# Altium schematic sheet tigard.SchDoc: =DocumentName
size A3; Date: 2024/12/30; Author: 阳光电路; CompanyName: 阳光电路; DrawnBy: Sunshine Circuit; Engineer: 阳光电路; Organization: Sunshine Circuit; Address1: 中国; Address2: 浙江; Address3: 杭州; Address4: 西湖区; DocumentNumber: 1; Revision: Rev 1.0.0; Version: Ver 2.0.0; Size: A3; Time: 00:00:00
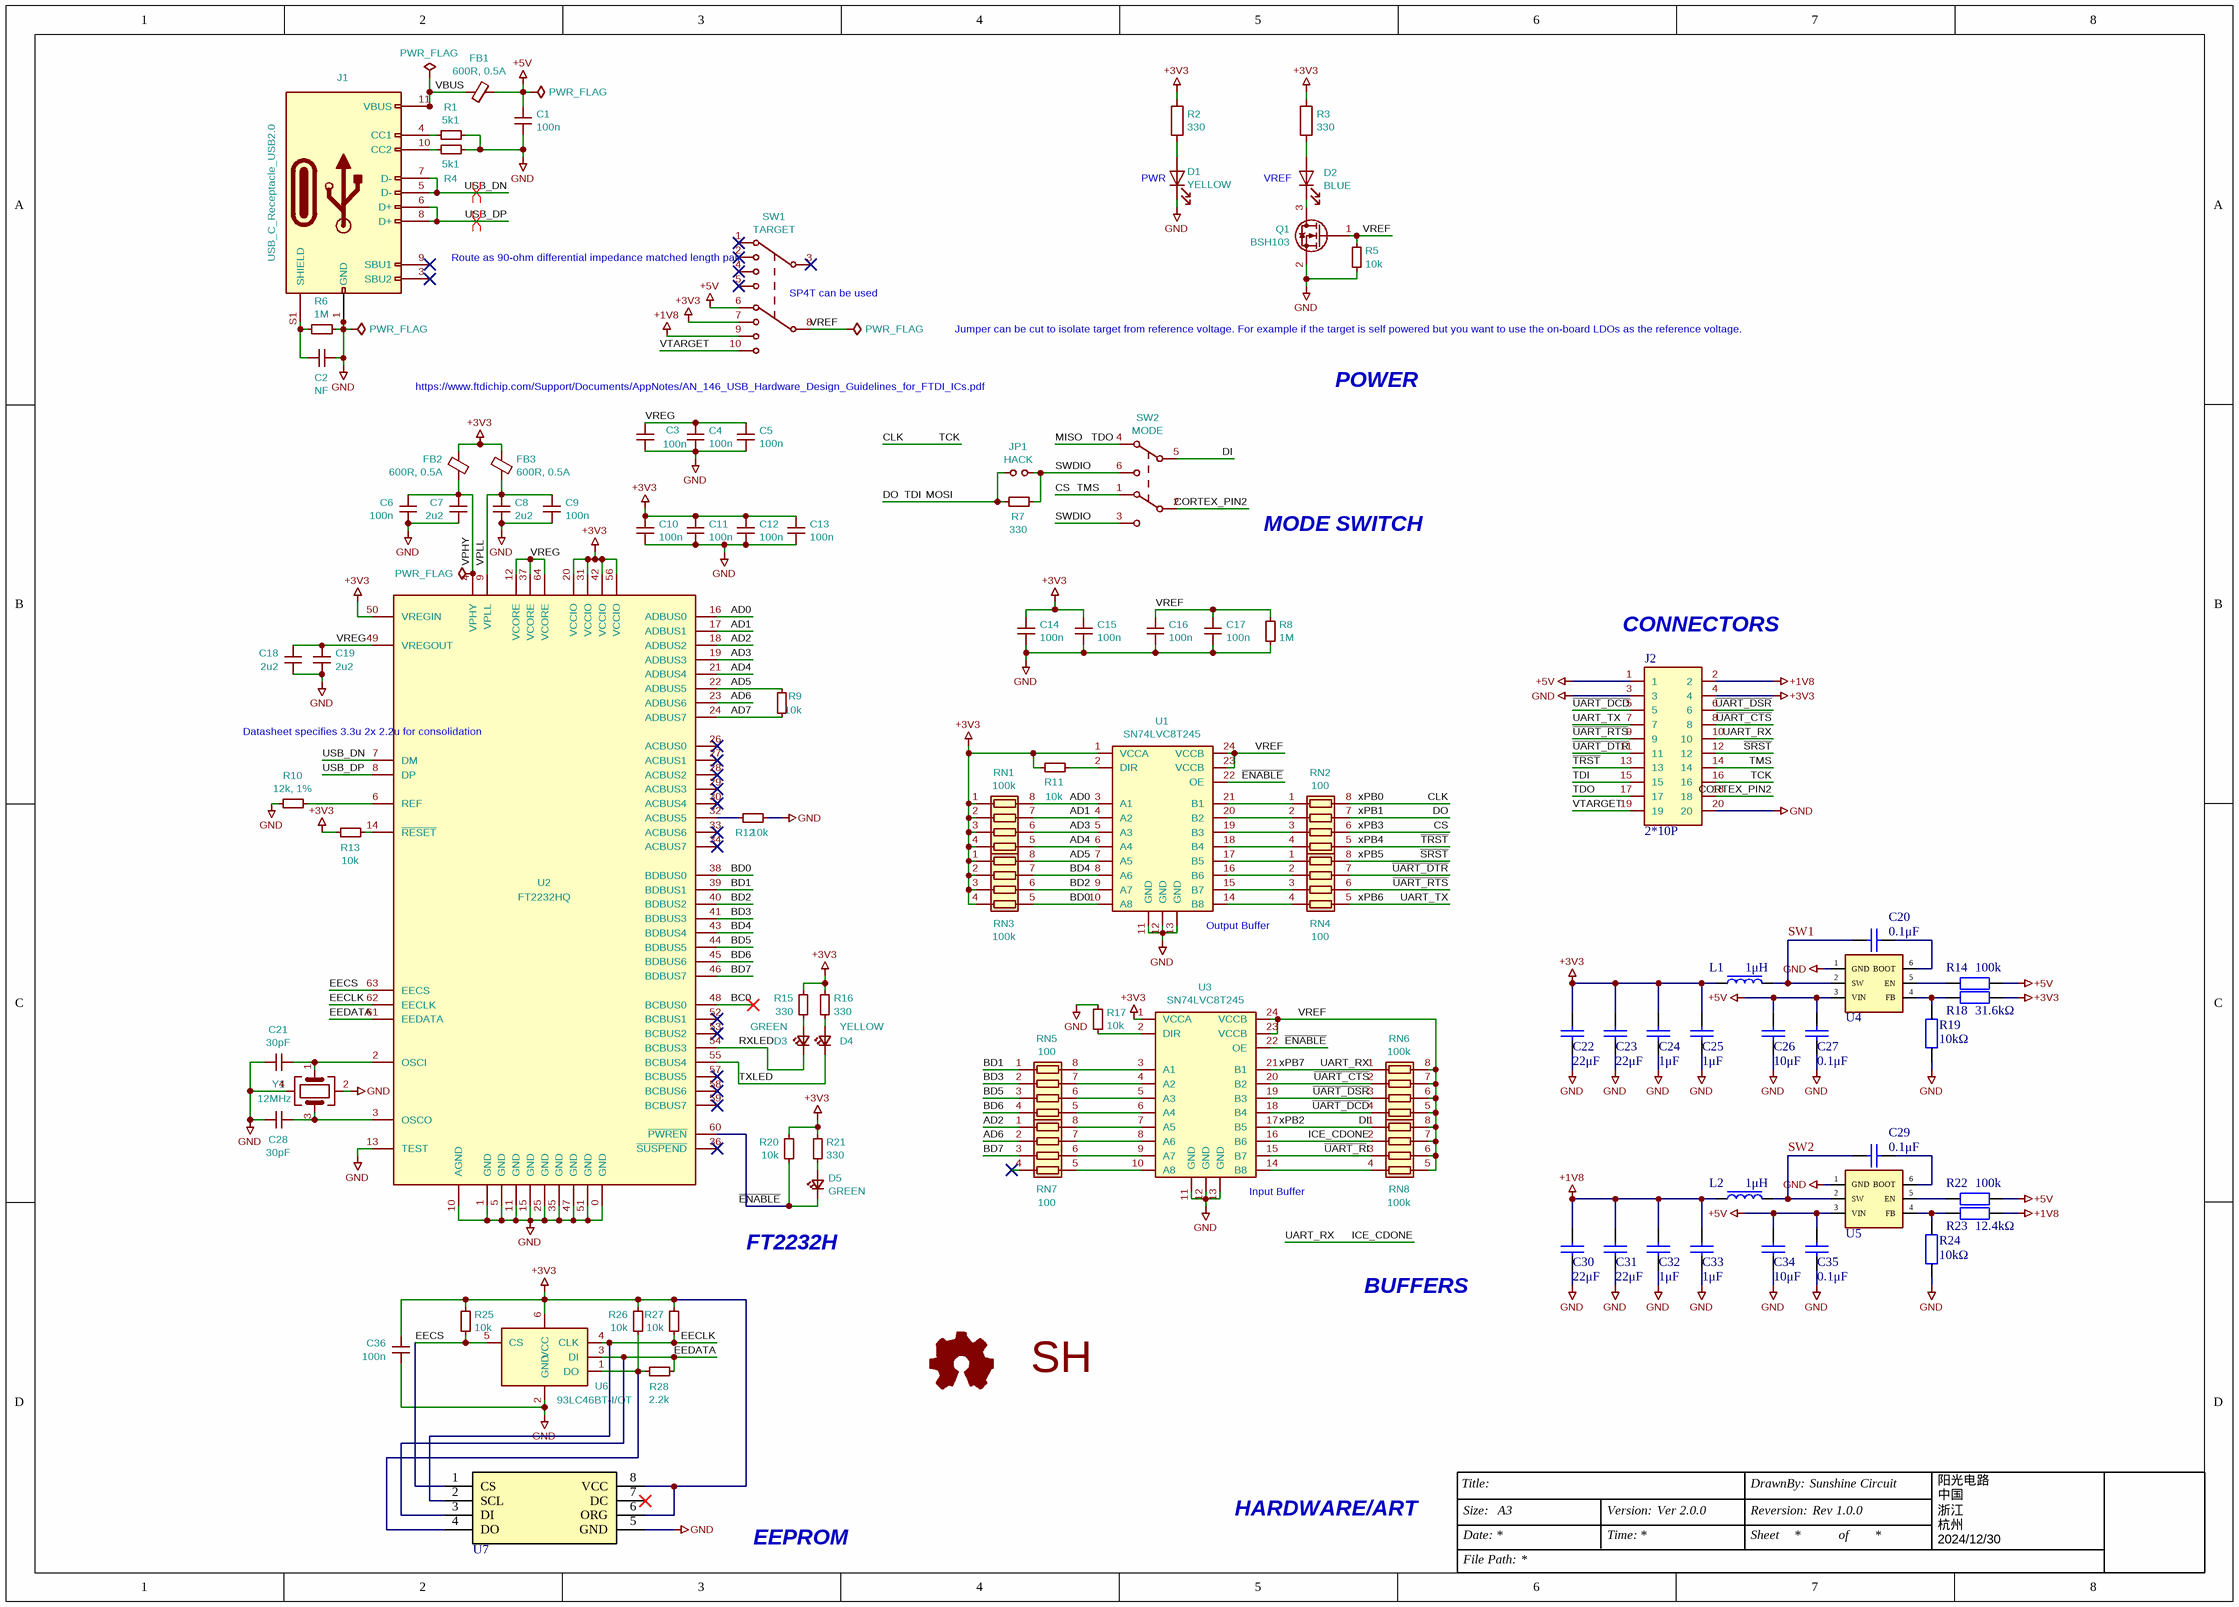
[diagram p0: tigard.SchDoc]

## Parts
#FLG0101  PWR_FLAG  (graphical)
#FLG0102  PWR_FLAG  (graphical)
#FLG0103  PWR_FLAG  (graphical)
#FLG0104  PWR_FLAG  (graphical)
#FLG0105  PWR_FLAG  (graphical)
C1  100n  [C0603]
C2  NF  [C0603]
C3  100n  [C0603]
C4  100n  [C0603]
C5  100n  [C0603]
C6  100n  [C0603]
C7  2u2  [C0603]
C8  2u2  [C0603]
C9  100n  [C0603]
C10  100n  [C0603]
C11  100n  [C0603]
C12  100n  [C0603]
C13  100n  [C0603]
C14  100n  [C0603]
C15  100n  [C0603]
C16  100n  [C0603]
C17  100n  [C0603]
C18  2u2  [C0603]
C19  2u2  [C0603]
C20  0.1μF  [C0603]
C21  30pF  [C0603]
C22  22μF  [C0603]
C23  22μF  [C0603]
C24  1μF  [C0603]
C25  1μF  [C0603]
C26  10μF  [C0603]
C27  0.1μF  [C0603]
C28  30pF  [C0603]
C29  0.1μF  [C0603]
C30  22μF  [C0603]
C31  22μF  [C0603]
C32  1μF  [C0603]
C33  1μF  [C0603]
C34  10μF  [C0603]
C35  0.1μF  [C0603]
C36  100n  [C0603]
D1  YELLOW  [LED 0603]
D2  BLUE  [LED 0603]
D3  GREEN  [LED 0603]
D4  YELLOW  [LED 0603]
D5  GREEN  [LED 0603]
FB1  600R, 0.5A  [R0603]
FB2  600R, 0.5A  [R0603]
FB3  600R, 0.5A  [R0603]
J1  USB_C_Receptacle_USB2.0  [USB-C_16PIN]
J2  2*10P  [2×10]
JP1  HACK  [SolderJumper-2_P1.3mm_Open_RoundedPad1.0x1.5mm]
L1  1μH  [NR4020]
L2  1μH  [NR4020]
LOGO1  Logo_Open_Hardware_Small  [OSHW-Symbol_4.4x4mm_SilkScreen]  (value not drawn)
LOGO2  Logo_SH  [Securing_Hardware_Logo]  (value not drawn)
Q1  BSH103  [SOT-523]
R1  5k1  [R0603]
R2  330  [R0603]
R3  330  [R0603]
R4  5k1  [R0603]
R5  10k  [R0603]
R6  1M  [R0603]
R7  330  [R0603]
R8  1M  [R0603]
R9  10k  [R0603]
R10  12k, 1%  [R0603]
R11  10k  [R0603]
R12  10k  [R0603]
R13  10k  [R0603]
R14  100k  [R0603]
R15  330  [R0603]
R16  330  [R0603]
R17  10k  [R0603]
R18  31.6kΩ  [R0603]
R19  10kΩ  [R0603]
R20  10k  [R0603]
R21  330  [R0603]
R22  100k  [R0603]
R23  12.4kΩ  [R0603]
R24  10kΩ  [R0603]
R25  10k  [R0603]
R26  10k  [R0603]
R27  10k  [R0603]
R28  2.2k  [R0603]
RN1  100k  [RCA-8P4R-0603]
RN2  100  [RCA-8P4R-0603]
RN3  100k  [RCA-8P4R-0603]
RN4  100  [RCA-8P4R-0603]
RN5  100  [RCA-8P4R-0603]
RN6  100k  [RCA-8P4R-0603]
RN7  100  [RCA-8P4R-0603]
RN8  100k  [RCA-8P4R-0603]
SW1  TARGET  [K3-2410S-F1]
SW2  MODE  [SK-3245S-L3-B]
U1  SN74LVC8T245  [TSSOP-24]
U2  FT2232HQ  [QFN64]
U3  SN74LVC8T245  [TSSOP-24]
U4  4.2V~17V 3A同步降压稳压器  [TSOT-23-6]  (value not drawn)
U5  4.2V~17V 3A同步降压稳压器  [TSOT-23-6]  (value not drawn)
U6  93LC46BT-I/OT  [TSOT-23-6]
U7  AT93CXX  [SOP-8(体宽3.8mm)]  (value not drawn)
Y1  12MHz  [3225-4]

## Nets
+1V8: C30.2 C31.2 C32.2 C33.2 J2.2 L2.2 R23.1 SW1.9
+3V3: C10.1 C11.1 C12.1 C13.1 C14.1 C15.1 C22.2 C23.2 C24.2 C25.2 C36.1 FB2.1 FB3.1 J2.4 L1.2 R2.1 R3.1 R11.1 R13.1 R15.2 R16.2 R18.1 R20.1 R21.2 R25.1 R26.1 R27.1 RN1.1(R1.1) RN1.2(R2.1) RN1.3(R3.1) RN1.4(R4.1) RN3.1(R1.1) RN3.2(R2.1) RN3.3(R3.1) RN3.4(R4.1) SW1.7 U1.1(VCCA) U2.20(VCCIO) U2.31(VCCIO) U2.42(VCCIO) U2.50(VREGIN) U2.56(VCCIO) U3.1(VCCA) U6.6(VCC) U7.6(ORG) U7.8(VCC)
+5V: #FLG0105.1(pwr) C1.1 C26.2 C27.2 C34.2 C35.2 FB1.1 J2.1 R14.1 R22.1 SW1.6 U4.3(VIN) U5.3(VIN)
GND: #FLG0102.1(pwr) C1.2 C2.1 C3.2 C4.2 C5.2 C6.2 C7.2 C8.2 C9.2 C10.2 C11.2 C12.2 C13.2 C14.2 C15.2 C16.2 C17.2 C18.2 C19.2 C21.2 C22.1 C23.1 C24.1 C25.1 C26.1 C27.1 C28.2 C30.1 C31.1 C32.1 C33.1 C34.1 C35.1 C36.2 D1.2(K) J1.1(GND) J1.12(GND) J1.13(GND) J1.14(GND) J1.15(GND) J1.16(GND) J2.3 J2.20 Q1.2(S) R1.1 R4.2 R5.1 R6.1 R8.2 R10.1 R12.2 R17.2 R19.1 R24.1 U1.11(GND) U1.12(GND) U1.13(GND) U2.0(GND) U2.1(GND) U2.5(GND) U2.10(AGND) U2.11(GND) U2.13(TEST) U2.15(GND) U2.25(GND) U2.35(GND) U2.47(GND) U2.51(GND) U3.11(GND) U3.12(GND) U3.13(GND) U4.1(GND) U5.1(GND) U6.2(GND) U7.5(GND) Y1.2 Y1.4
AD0: RN1.8(R1.2) U1.3(A1) U2.16(ADBUS0)
AD1: RN1.7(R2.2) U1.4(A2) U2.17(ADBUS1)
AD2: RN7.1(R1.1) U2.18(ADBUS2)
AD3: RN1.6(R3.2) U1.5(A3) U2.19(ADBUS3)
AD4: RN1.5(R4.2) U1.6(A4) U2.21(ADBUS4)
AD5: R9.1 RN3.8(R1.2) U1.7(A5) U2.22(ADBUS5)
AD6: RN7.2(R2.1) U2.23(ADBUS6)
AD7: R9.2 U2.24(ADBUS7)
BC0: U2.48(BCBUS0)
BD0: RN3.5(R4.2) U1.10(A8) U2.38(BDBUS0)
BD1: RN5.1(R1.1) U2.39(BDBUS1)
BD2: RN3.6(R3.2) U1.9(A7) U2.40(BDBUS2)
BD3: RN5.2(R2.1) U2.41(BDBUS3)
BD4: RN3.7(R2.2) U1.8(A6) U2.43(BDBUS4)
BD5: RN5.3(R3.1) U2.44(BDBUS5)
BD6: RN5.4(R4.1) U2.45(BDBUS6)
BD7: RN7.3(R3.1) U2.46(BDBUS7)
CLK: J2.16 RN2.8(R1.2)  [also labelled TCK, xPB0]
CORTEX_PIN2: J2.18 SW2.2
CS: J2.14 RN2.6(R3.2) SW2.1  [also labelled TMS, xPB3]
DI: RN8.1(R1.1) SW2.5 U3.17(B5)  [also labelled xPB2]
DO: J2.15 JP1.1 R7.2 RN2.7(R2.2)  [also labelled MOSI, TDI, xPB1]
~{ENABLE}: D5.2(K) R20.2 U1.22(OE) U2.60(~{PWREN}) U3.22(OE)
EECLK: R27.2 U2.62(EECLK) U6.4(CLK) U7.2(SCL)
EECS: R25.2 U2.63(EECS) U6.5(CS) U7.1(CS)
EEDATA: R28.1 U2.61(EEDATA) U6.3(DI) U7.3(DI)
ICE_CDONE: J2.10 RN6.1(R1.1) RN8.2(R2.1) U3.16(B6) U3.21(B1)  [also labelled UART_RX, xPB7]
MISO: J2.17 SW2.4  [also labelled TDO]
RXLED: D3.2(K) U2.54(BCBUS3)
~{SRST}: J2.12 RN4.8(R1.2)  [also labelled xPB5]
SW1: C20.2 L1.1 U4.2(SW)
SW2: C29.2 L2.1 U5.2(SW)
SWDIO: JP1.2 R7.1 SW2.3 SW2.6
~{TRST}: J2.13 RN2.5(R4.2)  [also labelled xPB4]
TXLED: D4.2(K) U2.55(BCBUS4)
~{UART_CTS}: J2.8 RN6.2(R2.1) U3.20(B2)
~{UART_DCD}: J2.5 RN6.4(R4.1) U3.18(B4)
~{UART_DSR}: J2.6 RN6.3(R3.1) U3.19(B3)
~{UART_DTR}: J2.11 RN4.7(R2.2)
~{UART_R}I: RN8.3(R3.1) U3.15(B7)
~{UART_RTS}: J2.9 RN4.6(R3.2)
UART_TX: J2.7 RN4.5(R4.2)  [also labelled xPB6]
USB_DN: J1.5(D-) J1.7(D-) U2.7(DM)
USB_DP: J1.6(D+) J1.8(D+) U2.8(DP)
VBUS: #FLG0101.1(pwr) FB1.2 J1.2(VBUS) J1.11(VBUS)
VPHY: #FLG0104.1(pwr) C6.1 C7.1 FB2.2 U2.4(VPHY)
VPLL: C8.1 C9.1 FB3.2 U2.9(VPLL)
VREF: #FLG0103.1(pwr) C16.1 C17.1 Q1.1(G) R5.2 R8.1 RN6.5(R4.2) RN6.6(R3.2) RN6.7(R2.2) RN6.8(R1.2) RN8.5(R4.2) RN8.6(R3.2) RN8.7(R2.2) RN8.8(R1.2) SW1.8 U1.23(VCCB) U1.24(VCCB) U3.23(VCCB) U3.24(VCCB)
VREG: C3.1 C4.1 C5.1 C18.1 C19.1 U2.12(VCORE) U2.37(VCORE) U2.49(VREGOUT) U2.64(VCORE)
VTARGET: J2.19 SW1.10
NetC2_2: C2.2 J1.S1(SHIELD) R6.2
NetC20_1: C20.1 U4.6(BOOT)
NetC21_1: C21.1 U2.2(OSCI) Y1.1
NetC28_1: C28.1 U2.3(OSCO) Y1.3
NetC29_1: C29.1 U5.6(BOOT)
NetD1_1: D1.1(A) R2.2
NetD2_1: D2.1(A) R3.2
NetD2_2: D2.2(K) Q1.3(D)
NetD3_1: D3.1(A) R15.1
NetD4_1: D4.1(A) R16.1
NetD5_1: D5.1(A) R21.1
NetJ1_4: J1.4(CC1) R1.2
NetJ1_10: J1.10(CC2) R4.1
NetR10_2: R10.2 U2.6(REF)
NetR11_2: R11.2 U1.2(DIR)
NetR12_1: R12.1 U2.32(ACBUS5)
NetR13_2: R13.2 U2.14(~{RESET})
NetR14_2: R14.2 U4.5(EN)
NetR17_1: R17.1 U3.2(DIR)
NetR18_2: R18.2 R19.2 U4.4(FB)
NetR22_2: R22.2 U5.5(EN)
NetR23_2: R23.2 R24.2 U5.4(FB)
NetR26_2: R26.2 R28.2 U6.1(DO) U7.4(DO)
NetRN2_1: RN2.1(R1.1) U1.21(B1)
NetRN2_2: RN2.2(R2.1) U1.20(B2)
NetRN2_3: RN2.3(R3.1) U1.19(B3)
NetRN2_4: RN2.4(R4.1) U1.18(B4)
NetRN4_1: RN4.1(R1.1) U1.17(B5)
NetRN4_2: RN4.2(R2.1) U1.16(B6)
NetRN4_3: RN4.3(R3.1) U1.15(B7)
NetRN4_4: RN4.4(R4.1) U1.14(B8)
NetRN5_5: RN5.5(R4.2) U3.6(A4)
NetRN5_6: RN5.6(R3.2) U3.5(A3)
NetRN5_7: RN5.7(R2.2) U3.4(A2)
NetRN5_8: RN5.8(R1.2) U3.3(A1)
NetRN7_5: RN7.5(R4.2) U3.10(A8)
NetRN7_6: RN7.6(R3.2) U3.9(A7)
NetRN7_7: RN7.7(R2.2) U3.8(A6)
NetRN7_8: RN7.8(R1.2) U3.7(A5)
NetRN8_4: RN8.4(R4.1) U3.14(B8)

Not connected (* = marked no-connect by the designer): J1 3(SBU2)* 9(SBU1)* A9(VBUS) B9(VBUS); RN7 4(R4.1)*; SW1 1* 2* 3* 4* 5*; U2 26(ACBUS0)* 27(ACBUS1)* 28(ACBUS2)* 29(ACBUS3)* 30(ACBUS4)* 33(ACBUS6)* 34(ACBUS7)* 36(~{SUSPEND})* 52(BCBUS1)* 53(BCBUS2)* 57(BCBUS5)* 58(BCBUS6)* 59(BCBUS7)*; U7 7(DC)*

## Layout directives
differential pair: USB_DN, USB_DP

## Notes on the sheet
- (near D1) PWR
- (near D2) VREF
- (near SW1) Route as 90-ohm differential
  impedance matched length pair
- (near SW1) SP4T can be used
- Jumper can be cut to isolate
  target from reference voltage.
  For example if the target is self
  powered but you want to use the
  on-board LDOs as the reference
  voltage.
- https://www.ftdichip.com/Support/Documents/AppNotes/AN_146_USB_Hardware_Design_Guidelines_for_FTDI_ICs.pdf
- POWER
- MODE SWITCH
- (near J2) CONNECTORS
- (near U2) Datasheet specifies 3.3u
  2x 2.2u for consolidation
- (near U1) Output Buffer
- (near U3) Input Buffer
- (near D5) FT2232H
- BUFFERS
- EEPROM
- HARDWARE/ART
- Title:
- DrawnBy:
- Size:
- Date:
- Version:
- Time:
- Reversion:
- Sheet
- of
- File Path:
- (in symbol Logo_SH) SH

## Library data of the parts
C1 C3-C6 C9-C17 C36 = C_Small: P/N: CL05A104KA5NNNC; Key: cap-cer-0402-100n; LCSC: C100072; Value: 100n; Footprint: Capacitor_SMD:C_0402_1005Metric
C2 = C_Small: Value: NF; Footprint: Capacitor_SMD:C_0402_1005Metric
C7 C8 C18 C19 = C_Small: P/N: CL10A225KQ8NNNC; Key: cap-cer-0402-2u2; LCSC: C71000; Value: 2u2; Footprint: Capacitor_SMD:C_0402_1005Metric
C20 C22-C27 C29-C35 = Non-Polar_Capacitor: 贴片\直插无极性电容
C21 C28 = C_Small: P/N: CL05C300JB5NNNC; Key: cap-cer-0402-30pF; LCSC: C159804; Value: 30pF; Footprint: Capacitor_SMD:C_0402_1005Metric
D1 = LED: P/N: LTST-C193KSKT-5A; Key: led-0603-yel; LCSC: C160477; Value: YELLOW; Footprint: LED_SMD:LED_0603_1608Metric
D2 = LED: P/N: LTST-C193TBKT-2A; Key: led-0603-blu; LCSC: C157738; Value: BLUE; Footprint: LED_SMD:LED_0603_1608Metric
D3 D5 = LED_Small: P/N: LTST-C193TGKT-5A; Key: led-0603-grn; LCSC: C12065; Value: GREEN; Footprint: LED_SMD:LED_0603_1608Metric
D4 = LED_Small: P/N: LTST-C193KSKT-5A; Key: led-0603-yel; LCSC: C160477; Value: YELLOW; Footprint: LED_SMD:LED_0603_1608Metric
FB1-FB3 = Ferrite_Bead_Small: P/N: BLM15AX601SN1D; Key: ferrite-0402-600; LCSC: C76886; Value: 600R, 0.5A; Footprint: Inductor_SMD:L_0402_1005Metric
J1 = USB_C_Receptacle_USB2.0: P/N: TYPE-C-31-M-12; Key: conn-smd-usb-c-2; LCSC: C165948; Value: USB_C_Receptacle_USB2.0; Footprint: tigard:USB_C_Receptacle_HRO_TYPE-C-31-M-12
JP1 = Jumper_NO_Small: Value: HACK; Footprint: Jumper:SolderJumper-2_P1.3mm_Open_RoundedPad1.0x1.5mm
L1 L2 = Inductor: 贴片\直插电感
Q1 = Q_NMOS_GSD: P/N: BSH103,235; Key: mosfet-sot-23-bsh103; LCSC: C88711; Value: BSH103; Footprint: tigard:SOT-23_RoundRect
R1 R4 = R_Small: P/N: 0402WGJ0512TCE; Key: res-0402-5k1; LCSC: C25941; Value: 5k1; Footprint: Resistor_SMD:R_0402_1005Metric
R2 R3 = R: P/N: 0402WGF3300TCE; Key: res-0402-330; LCSC: C25104; Value: 330; Footprint: Resistor_SMD:R_0402_1005Metric
R5 R9 R11-R13 R17 R20 R25-R27 = R_Small: P/N: 040200J0103TCE; Key: res-0402-10k; LCSC: C301923; Value: 10k; Footprint: Resistor_SMD:R_0402_1005Metric
R6 = R_Small: Key: res-0402-1M; Value: 1M; Footprint: Resistor_SMD:R_0402_1005Metric
R7 R15 R16 R21 = R_Small: P/N: 0402WGF3300TCE; Key: res-0402-330; LCSC: C25104; Value: 330; Footprint: Resistor_SMD:R_0402_1005Metric
R8 = R_Small: P/N: 0402WGF1004TCE; Key: res-0402-1M; LCSC: C26083; Value: 1M; Footprint: Resistor_SMD:R_0402_1005Metric
R10 = R_Small: P/N: 0402WGF1202TCE; Key: res-0402-12k; LCSC: C25752; Value: 12k, 1%; Footprint: Resistor_SMD:R_0402_1005Metric
R14 R18 R19 R22-R24 = Resistor: 贴片/直插电阻
R28 = R_Small: P/N: 0402WGF2201TCE; Key: res-0402-2k2; LCSC: C25879; Value: 2.2k; Footprint: Resistor_SMD:R_0402_1005Metric
RN1 RN3 RN6 RN8 = R_Pack04: P/N: 4D02WGJ0104TCE; Key: res-0402cv-array-4-100k; LCSC: C25724; Value: 100k; Footprint: tigard:R_Array_Convex_4x0402_RoundRect
RN2 RN4 RN5 RN7 = R_Pack04: P/N: 4D02WGJ0101TCE; Key: res-0402cv-array-4-100; LCSC: C48442; Value: 100; Footprint: tigard:R_Array_Convex_4x0402_RoundRect
SW1 = SW_DP4T: P/N: SSSS224100; Key: sw-toggle-dp4t; LCSC: C255514; Value: TARGET; Footprint: tigard:SW_ALPS_SSSS224100_DP4T
SW2 = SW_DPDT: P/N: JS202011CQN; Key: sw-toggle-dpdt; LCSC: C221663; Value: MODE; Footprint: tigard:SW_CuK_JS202011CQN_DPDT_Straight
U1 U3 = SN74LVC8T245: P/N: SN74LVC8T245PWR; Key: ic-tssop24-sn74lvc8t245; LCSC: C27643; Value: SN74LVC8T245; Footprint: Package_SO:TSSOP-24_4.4x7.8mm_P0.65mm
U2 = FT2232HQ: P/N: FT2232HQ-REEL; Key: ic-ft2232h; LCSC: C193662; Value: FT2232HQ; Footprint: Package_DFN_QFN:QFN-64-1EP_9x9mm_P0.5mm_EP4.35x4.35mm_ThermalVias
U4 U5 = SCT2230
U6 = 93LCxxBxxOT: P/N: 93LC56BT-I/OT; Key: eeprom-sot23-6-93c46b; LCSC: C190271; Value: 93LC46BT-I/OT; Footprint: tigard:SOT-23-6_RoundRect
U7 = AT93CXX: EEPROM
Y1 = Crystal_GND24: P/N: X322512MSB4SI; Key: xtal-smd-3225-4-12mhz; LCSC: C9002; Value: 12MHz; Footprint: tigard:Crystal_SMD_3225-4Pin_3.2x2.5mm_RoundRect
#FLG0101 #FLG0102 #FLG0103 #FLG0104 #FLG0105 = PWR_FLAG: Value: PWR_FLAG
LOGO1 = Logo_Open_Hardware_Small: Value: Logo_Open_Hardware_Small; Footprint: tigard:OSHW-Symbol_4.4x4mm_SilkScreen
LOGO2 = Logo_SH: Value: Logo_SH; Footprint: tigard:Securing_Hardware_Logo